# Altium project BMS_MasterboardUpdated.PrjPcb (part 1 of 2)
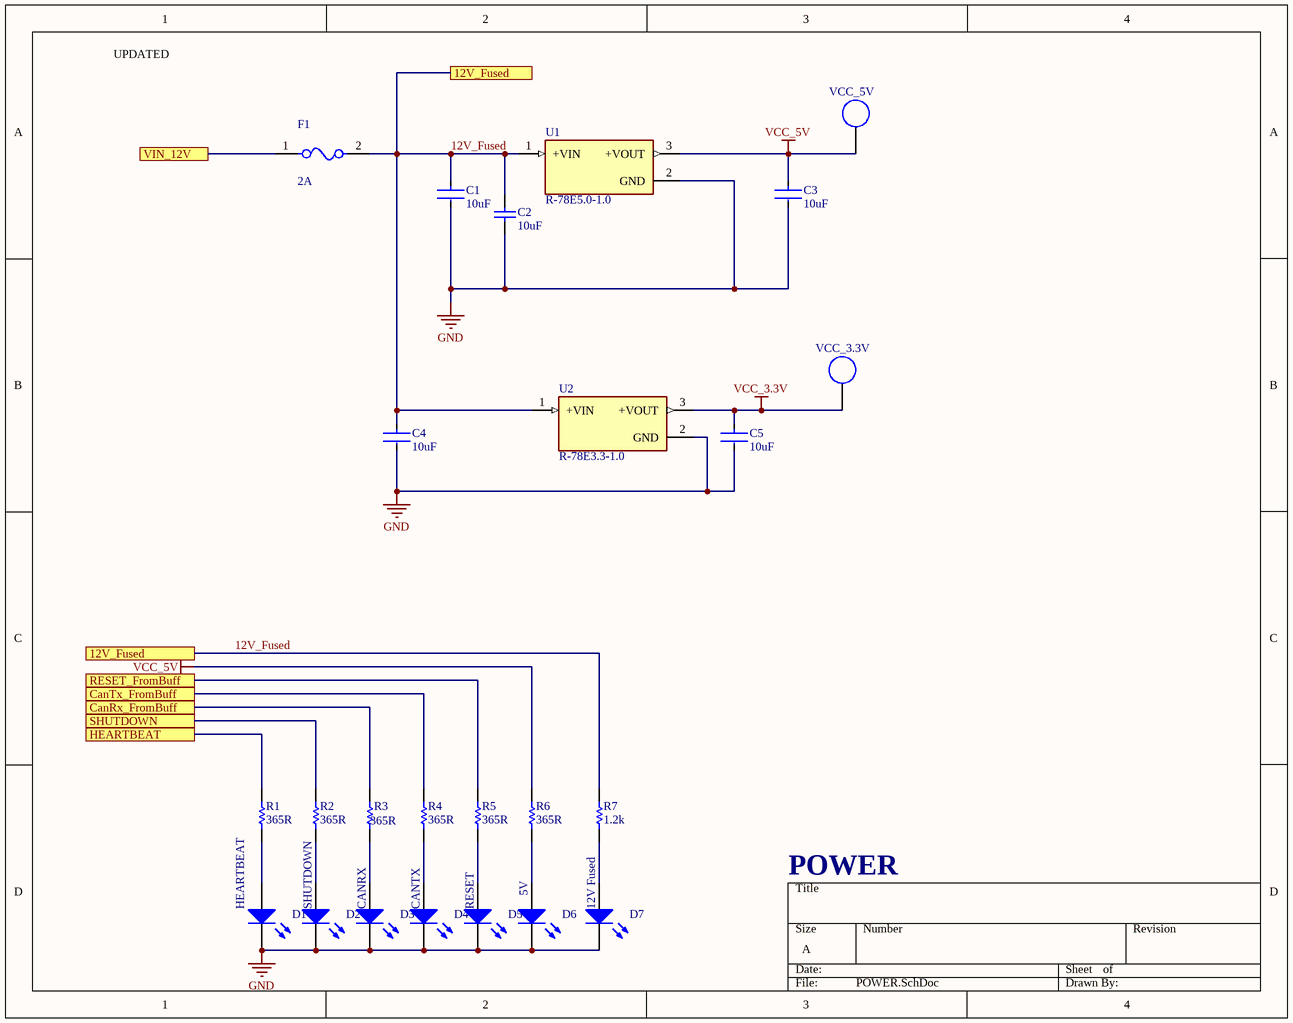
[diagram p0: POWER.SchDoc]
4 sheets, 102 parts. Net scope: flat (ports and power ports of the same name join across sheets).
Board files: MasterBoardRevA.PcbDoc, MasterBoardRevB.PcbDoc, MasterBoardRevC.PcbDoc
Sheets:
  POWER.SchDoc
  CONNECTORS.SchDoc
  PROCESSOR.SchDoc
  COMMUNICATIONS.SchDoc

## Sheet POWER.SchDoc
size A

### Parts
C1  10uF  [FP-C2012-125-0_2-MFG]
C2  10uF  [CAPPRD200W50D550H1250]
C3  10uF  [FP-C2012-125-0_2-MFG]
C4  10uF  [FP-C2012-125-0_2-MFG]
C5  10uF  [FP-C2012-125-0_2-MFG]
D1  HEARTBEAT  [0805_A]
D2  SHUTDOWN  [0805_A]
D3  CANRX  [0805_A]
D4  CANTX  [0805_A]
D5  RESET  [0805_A]
D6  5V  [0805_A]
D7  12V Fused  [0805_A]
F1  2A  [FP-0154-MFG]
R1  365R  [RESC2013X60X35ML10T20]
R2  365R  [RESC2013X60X35ML10T20]
R3  365R  [RESC2013X60X35ML10T20]
R4  365R  [RESC2013X60X35ML10T20]
R5  365R  [RESC2013X60X35ML10T20]
R6  365R  [RESC2013X60X35ML10T20]
R7  1.2k  [RESC2013X60X35ML10T20]
U1  R-78E5.0-1.0  [CONV_R-78E5.0-1.0]
U2  R-78E3.3-1.0  [CONV_R-78E3.3-1.0]
VCC_3.3V  5015  [5015]  (value not drawn)
VCC_5V  5015  [5015]  (value not drawn)

### Ports
12V_Fused, CanRx_FromBuff, CanTx_FromBuff, HEARTBEAT, RESET_FromBuff, SHUTDOWN, VIN_12V

### Nets
GND: C1.2 C2.2(Neg) C3.2 C4.2 C5.2 D1.1(K) D2.1(K) D3.1(K) D4.1(K) D5.1(K) D6.1(K) D7.1(K) U1.2(GND) U2.2(GND)
VCC_3.3V: C5.1 U2.3(+VOUT) VCC_3.3V.1
VCC_5V: C3.1 R6.2 U1.3(+VOUT) VCC_5V.1
12V_Fused: C1.1 C2.1(Pos) C4.1 F1.2 R7.2 U1.1(+VIN) U2.1(+VIN) ; port 12V_Fused
CanRx_FromBuff: R3.2 ; port CanRx_FromBuff
CanTx_FromBuff: R4.2 ; port CanTx_FromBuff
HEARTBEAT: R1.2 ; port HEARTBEAT
RESET_FromBuff: R5.2 ; port RESET_FromBuff
SHUTDOWN: R2.2 ; port SHUTDOWN
NetD1_2: D1.2(A) R1.1
NetD2_2: D2.2(A) R2.1
NetD3_2: D3.2(A) R3.1
NetD4_2: D4.2(A) R4.1
NetD5_2: D5.2(A) R5.1
NetD6_2: D6.2(A) R6.1
NetD7_2: D7.2(A) R7.1
NetF1_1: F1.1 ; port VIN_12V

### Notes on the sheet
- (near F1) UPDATED
- POWER

### Library data of the parts
C1 C3-C5 = CMP-08246-003655-1: Multilayer Ceramic Capacitors 10μF ±10% 16V X6S SMD 0805; Contact Plating: Tin; Height: 1.25mm; Thickness: 0.057inch; Case Code (Metric): 2012; Dielectric Material: Ceramic; Tolerance: 10%; Depth: 1.25mm; Length: 2mm; Lead Free: Lead Free; RoHS Compliant: Yes; Case/Package: 0805; REACH SVHC: No SVHC; Capacitance: 10uF; Construction: Flat; Voltage Rating: 16V; Max Operating Temperature: 105°C; Series: C; Width: 0.049inch; Voltage Rating (DC): 16V; Packaging: Tape and Reel; Package Quantity: 1; Min Operating Temperature: -55°C; Mount: Surface Mount; Dielectric: X6S; Case Code (Imperial): 0805; Supplier 1: Digi-Key; Supplier Part Number 1: 445-7611-1-ND
C2 = Cap, TH, Electrolytic_5mm: Cap Alum 10UF 20% 25V Radial; Manufacturer 1: KEMET; Manufacturer Part Number 1: ESW106M025AC3AA; TargetLibrary: RITRacing-Passives; Value: Value?; Publisher: T.Tallo; Published: 22Oct2016; Status: Active; Supplier 1: Digi-Key; Supplier Part Number 1: 399-ESW106M025AC3AA-ND; Stock 1: 7476; Pricing 1: 1=0.23000, 10=0.15400, 50=0.09260, 100=0.07820, 500=0.05352, 1000=0.04735, 2500=0.04529, 5000=0.04117 (USD); RoHS Compliant: Yes
D1-D7 = CMP-1426-00009-1: SMD mono-color Chip LED, WL-SMCW, Bright Green; PartNumber: 150080VS75000; Manufacturer: Wuerth Elektronik; Manufacturer 1: Wurth Electronics; Luminous Intensity: 40mcd; Forward Current: 30mA; Forward Voltage: 2V; Viewing Angle: 140°; Wavelength: 570nm; Lens Style: Clear,Rectangular; Test Current: 20mA; ComponentLink1Description: Manufacturer URL; Color: Bright Green; PackageReference: 0805_A; ComponentLink1URL: http://www.we-online.com; ComponentLink2Description: Datasheet; ComponentLink2URL: http://katalog.we-online.com/led/datasheet/150080VS75000.pdf; Supplier 1: Digi-Key; Supplier Part Number 1: 732-4986-1-ND; Manufacturer Part Number 1: 150080VS75000; RoHS: Yes; Category: LEDs; Stock 1: 20997; Pricing 1: 1=0.18000, 50=0.16500, 100=0.14200, 500=0.12300 (USD); Mount: Surface Mount; Case/Package: 0805; Case Code (Metric): 2012; Case Code (Imperial): 0805; Min Operating Temperature: -40°C; Max Operating Temperature: 85°C; Package Quantity: 4000; Packaging: Tape and Reel; Dominant Wavelength: 570nm; Length: 2mm; Width: 1.25mm; Height: 0.7mm; REACH SVHC: Unknown; ComponentLink3URL: https://datasheet.ciiva.com/22656/150080vs75000-22656966.pdf?src-supplier=Element14; ComponentLink3Description: https://datasheet.ciiva.com/22656/150080vs75000-22656966.pdf?src-supplier=Element14; ComponentLink4URL: https://datasheet.ciiva.com/29279/759437-da-01-en-chipled-0805-w-kl-h-gruen-150080vs7500-29279047.pdf?src-supplier=Conrad; ComponentLink4Description: https://datasheet.ciiva.com/29279/759437-da-01-en-chipled-0805-w-kl-h-gruen-150080vs7500-29279047.pdf?src-supplier=Conrad; ComponentLink5URL: https://datasheet.ciiva.com/29563/150080vs75000-29563018.pdf?src-supplier=Digi-Key; ComponentLink5Description: https://datasheet.ciiva.com/29563/150080vs75000-29563018.pdf?src-supplier=Digi-Key
F1 = CMP-08605-000033-1: FUSE BOARD MNT 2A 125VAC/VDC SMD; Manufacturer Part Number: 0154002.DR; Manufacturer: Littelfuse; Fuse I2T: 8.2A2Sec; Voltage Rating: 125V; Value: 0.0625Ω; Fuse Blow Speed: Fast; ComponentLink2URL: https://www.littelfuse.com/~/media/electronics/datasheets/fuses/littelfuse_fuse_154_154t_154l_154tl_datasheet.pdf.pdf; Digikey Description: FUSE BOARD MNT 2A 125VAC/VDC SMD; Temperature Range Low: -55°C; Mouser Description: 154 Series Fast-Acting 125 V 2 A 9.73 x 5.03 mm OMNI-BLOK® SMT Fuse & Holder; Device Class L1: Circuit Protection; Temperature: -55°C to +125°C; Automotive: No; ComponentLink2Description: Datasheet; Device Class L3: unset; Octopart: https://octopart.com/0154002.dr-littelfuse-565858; Height: 3.81mm; Fuse Current: 2A; Temperature Range High: +125°C; RoHS: TRUE; Max Fuse Ac Voltage: 125V; Category: Fuse; Package: 0154; Lead Free: Yes; Device Class L2: Fuses; Max Fuse Dc Voltage: 125V; Resistance: 0.0625Ω; Supplier 1: Digi-Key; Supplier Part Number 1: F1224CT-ND
R1-R6 = CMP-2001-01100-1: Part Number: RC0805FR-07365RL; Manufacturer: Yageo
R7 = CMP-2001-00959-1: Part Number: RC0805FR-071K24L; Manufacturer: Yageo
U1 = R-78E5.0-1.0: 1A DC/DC-Converter 'INNOLINE' SIP3 reg; MF: Recom Power; Price: None; Availability: Unavailable; SnapEDA_Link: https://www.snapeda.com/parts/R-78E5.0-1.0/Recom%20Power/view-part/557753/?ref=snap; Value: *; Package: SIP-3 Recom Power; MP: R-78E5.0-1.0; Supplier 1: Digi-Key; Supplier Part Number 1: 945-2201-ND
U2 = R-78E3.3-1.0: 1A DC/DC-Converter 'INNOLINE' SIP3 reg; MF: Recom Power; Package: SIP-3 Recom Power; Digi-Key_Part_Number: 945-2409-5-ND; SnapEDA_Link: https://www.snapeda.com/parts/R-78E3.3-0.5/Recom%20Power/view-part/229066/?ref=snap; Digi-Key_Purchase_URL: https://www.digikey.com/en/products/detail/recom-power/R-78E3-3-1-0/5327711; Value: *; MP: R-78E3.3-1.0; Supplier 1: Digi-Key; Supplier Part Number 1: 945-2409-5-ND
VCC_3.3V VCC_5V = 5015: SMD Test Point; Manufacturer: Keystone Electronics; TargetLibrary: RITRacing-Connectors; PartNumber: 5015; Publisher: T.Tallo; Published: 22Oct2016; Status: Active; ComponentLink1URL: http://www.mouser.com/ds/2/215/005-5009-743680.pdf; ComponentLink1Description: Datasheet

## Sheet CONNECTORS.SchDoc
size A
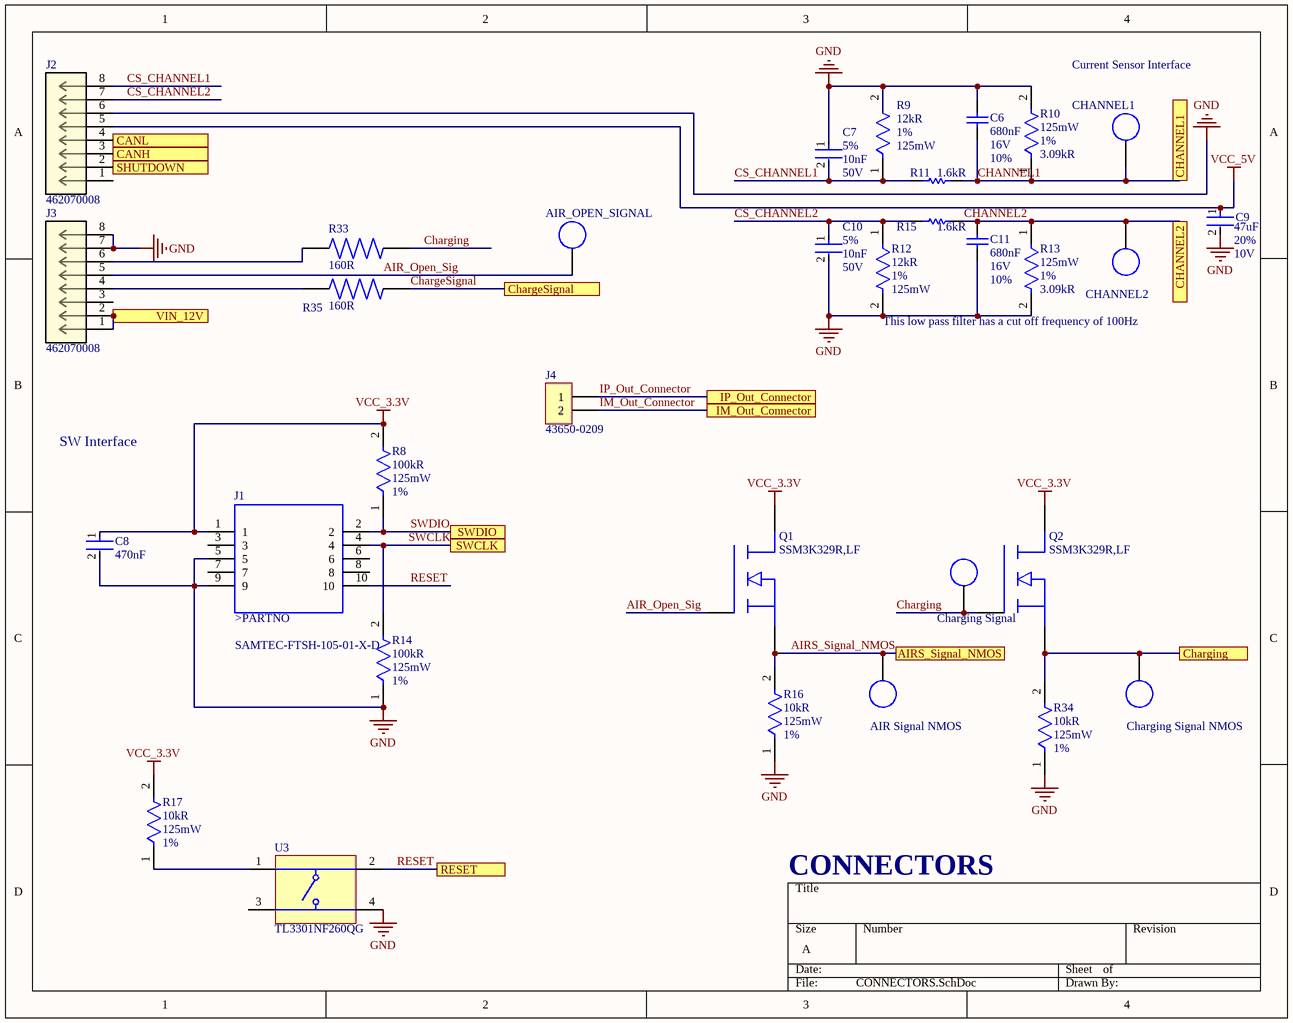
[diagram p1: CONNECTORS.SchDoc]

### Parts
AIR_OPEN_SIGNAL  5015  [5015]  (value not drawn)
AIR_Signal_NMOS  5015  [5015]  (value not drawn)
C6  Capacitance: 680nF  Voltage Rating: 16V  Tolerance: 10%  [CAPC2013X95X45NL10T25]  (hidden comment: GRM219R71C684KA01D)
C7  Tolerance: 5%  Capacitance: 10nF  Voltage Rating (DC): 50V  [FP-GRM219-0_1-IPC_B]  (hidden comment: GRM2195C1H103JA01D)
C8  470nF  [FP-GCM21B-0_15-IPC_A]
C9  Capacitance: 47uF  Tolerance: 20%  Voltage: 10V  [FP-GRM21B-0_2-e0_2_0_7-IPC_A]  (hidden comment: GRM21BR61A476ME15L)
C10  Tolerance: 5%  Capacitance: 10nF  Voltage Rating (DC): 50V  [FP-GRM219-0_1-IPC_B]  (hidden comment: GRM2195C1H103JA01D)
C11  Capacitance: 680nF  Voltage Rating: 16V  Tolerance: 10%  [CAPC2013X95X45NL10T25]  (hidden comment: GRM219R71C684KA01D)
CHANNEL1  5015  [5015]  (value not drawn)
CHANNEL2  5015  [5015]  (value not drawn)
Charging_Signal  5015  [5015]  (value not drawn)
Charging_Signal_NMOS  5015  [5015]  (value not drawn)
J1  SAMTEC-FTSH-105-01-X-D  [SAMTEC-FTSH-105-01-X-D]  (value not drawn)
J2  462070008  [CON_462070008]
J3  462070008  [CON_462070008]
J4  43650-0209  [43650-0209]
Q1  SSM3K329R,LF  [SOT23-3]
Q2  SSM3K329R,LF  [SOT23-3]
R8  Resistance: 100kR  Power Rating: 125mW  Tolerance: 1%  [FP-CRCW0805-e3-MFG]  (hidden comment: CRCW0805100KFKEA)
R9  Resistance: 12kR  Tolerance: 1%  Max Power Dissipation: 125mW  [FP-CRCW0805-e3-IPC_A]  (hidden comment: CRCW080512K0FKEA)
R10  Power Rating: 125mW  Tolerance: 1%  Resistance: 3.09kR  [FP-CRCW0805-e3-IPC_C]  (hidden comment: CRCW08053K09FKEA)
R11  Resistance: 1.6kR  [RESC2013X50X30LL20T20]  (hidden comment: CRCW08051K60FKEA)
R12  Resistance: 12kR  Tolerance: 1%  Max Power Dissipation: 125mW  [FP-CRCW0805-e3-IPC_A]  (hidden comment: CRCW080512K0FKEA)
R13  Power Rating: 125mW  Tolerance: 1%  Resistance: 3.09kR  [FP-CRCW0805-e3-IPC_C]  (hidden comment: CRCW08053K09FKEA)
R14  Resistance: 100kR  Power Rating: 125mW  Tolerance: 1%  [FP-CRCW0805-e3-MFG]  (hidden comment: CRCW0805100KFKEA)
R15  Resistance: 1.6kR  [RESC2013X50X30LL20T20]  (hidden comment: CRCW08051K60FKEA)
R16  Resistance: 10kR  Power Rating: 125mW  Resistance Tolerance: 1%  [FP-CRCW0805-e3-IPC_A]  (hidden comment: CRCW080510K0FKEA)
R17  Resistance: 10kR  Power Rating: 125mW  Resistance Tolerance: 1%  [FP-CRCW0805-e3-IPC_A]  (hidden comment: CRCW080510K0FKEA)
R33  Resistance: 160R  [RES_ERJP06J161V]  (hidden comment: ERJP06J161V)
R34  Resistance: 10kR  Power Rating: 125mW  Resistance Tolerance: 1%  [FP-CRCW0805-e3-IPC_A]  (hidden comment: CRCW080510K0FKEA)
R35  Resistance: 160R  [RES_ERJP06J161V]  (hidden comment: ERJP06J161V)
U3  TL3301NF260QG  [TECO-FSM4JSMA_V]

### Ports
AIRS_Signal_NMOS, CANH, CANL, CHANNEL1, CHANNEL2, ChargeSignal, Charging, IM_Out_Connector, IP_Out_Connector, RESET, SHUTDOWN, SWCLK, SWDIO, VIN_12V

### Nets
GND: C6.2 C7.1 C8.2 C9.2 C10.2 C11.1 J1.5 J1.9 J2.6 J3.7 J3.8 R9.2 R10.2 R12.2 R13.2 R14.1 R16.1 R34.1 U3.4
VCC_3.3V: C8.1 J1.1 Q1.3(Drain) Q2.3(Drain) R8.2 R17.2
VCC_5V: C9.1 J2.5
AIR_Open_Sig: AIR_OPEN_SIGNAL.1 J3.5 Q1.1(Gate)
AIRS_Signal_NMOS: AIR_Signal_NMOS.1 Q1.2(Source) R16.2 ; port AIRS_Signal_NMOS
CANH: J2.3 ; port CANH
CANL: J2.4 ; port CANL
CHANNEL1: C6.1 CHANNEL1.1 R10.1 R11.2 ; port CHANNEL1
CHANNEL2: C11.2 CHANNEL2.1 R13.1 R15.2 ; port CHANNEL2
ChargeSignal: R35.1 ; port ChargeSignal
Charging: Charging_Signal_NMOS.1 Q2.2(Source) R34.2 ; port Charging
Charging: Charging_Signal.1 Q2.1(Gate) R33.1  [a separate net that carries the same name]
CS_CHANNEL1: C7.2 J2.8 R9.1 R11.1
CS_CHANNEL2: C10.1 J2.7 R12.1 R15.1
IM_Out_Connector: J4.2 ; port IM_Out_Connector
IP_Out_Connector: J4.1 ; port IP_Out_Connector
RESET: J1.10 U3.2 ; port RESET
SHUTDOWN: J2.2 ; port SHUTDOWN
SWCLK: J1.4 R14.2 ; port SWCLK
SWDIO: J1.2 R8.1 ; port SWDIO
NetF1_1: J3.1 J3.2 ; port VIN_12V
NetJ3_4: J3.4 R35.2
NetJ3_6: J3.6 R33.2
NetR17_1: R17.1 U3.1

Not connected (* = marked no-connect by the designer): J1 3 6 7 8; J2 1; J3 3; U3 3

### Notes on the sheet
- Current Sensor Interface
- This low pass filter has a cut off frequency of 100Hz
- SW Interface
- CONNECTORS
- (in symbol SAMTEC-FTSH-105-01-X-D) >PARTNO

### Library data of the parts
AIR_OPEN_SIGNAL AIR_Signal_NMOS CHANNEL1 CHANNEL2 Charging_Signal Charging_Signal_NMOS = 5015: as VCC_3.3V on sheet POWER; PartNumber: 5015; Publisher: T.Tallo; Published: 22Oct2016; Status: Active; ComponentLink1URL: http://www.mouser.com/ds/2/215/005-5009-743680.pdf; ComponentLink1Description: Datasheet
C6 C11 = CMP-2007-00190-1: Manufacturer: Murata; Material: Ceramic; Dielectric: X7R; Part Number: GRM219R71C684KA01D; Supplier 1: Digi-Key; Supplier Part Number 1: 490-4741-1-ND; Manufacturer 1: Murata; Manufacturer Part Number 1: GRM219R71C684KA01D; RoHS: Yes; Category: Ceramic Capacitors; Stock 1: 28535; Pricing 1: 1=0.33000, 10=0.22300, 50=0.14860, 100=0.12630, 500=0.08914, 1000=0.07800 (USD); Mount: Surface Mount; Case/Package: 0805; Case Code (Imperial): 0805; Case Code (Metric): 2012; Min Operating Temperature: -55°C; Max Operating Temperature: 125°C; Voltage Rating (DC): 16V; Packaging: Tape and Reel; Package Quantity: 1; Termination: SMD/SMT; Series: GRM; Construction: Flat; Voltage: 16V; Length: 2mm; Width: 1.25mm; Height: 0.85mm; Thickness: 0.037inch; Depth: 1.25mm; Radiation Hardening: No; RoHS Compliant: Yes; Lead Free: Lead Free; ComponentLink1URL: https://datasheet.ciiva.com/136/grm219r71c684ka01-01-136854.pdf?src-supplier=Digi-Key; ComponentLink1Description: https://datasheet.ciiva.com/136/grm219r71c684ka01-01-136854.pdf?src-supplier=Digi-Key; ComponentLink2URL: https://datasheet.ciiva.com/136/grm219r71c684ka01-01-136855.pdf?src-supplier=Digi-Key; ComponentLink2Description: https://datasheet.ciiva.com/136/grm219r71c684ka01-01-136855.pdf?src-supplier=Digi-Key; ComponentLink3URL: https://datasheet.ciiva.com/136/grm219r71c684ka01-01-136856.pdf?src-supplier=Digi-Key; ComponentLink3Description: https://datasheet.ciiva.com/136/grm219r71c684ka01-01-136856.pdf?src-supplier=Digi-Key; ComponentLink4URL: https://datasheet.ciiva.com/5426/product-5426512.pdf?src-supplier=Mouser; ComponentLink4Description: https://datasheet.ciiva.com/5426/product-5426512.pdf?src-supplier=Mouser; ComponentLink5URL: https://datasheet.ciiva.com/11464/product-11464042.pdf?src-supplier=Avnet; ComponentLink5Description: https://datasheet.ciiva.com/11464/product-11464042.pdf?src-supplier=Avnet; Supplier 2: Digi-Key; Supplier Part Number 2: 490-4741-6-ND; Manufacturer 2: Murata; Manufacturer Part Number 2: GRM219R71C684KA01D; Stock 2: 28535; Pricing 2: 1=0.33000, 10=0.22300, 50=0.14860, 100=0.12630, 500=0.08914, 1000=0.07800 (USD); Supplier 3: Mouser; Supplier Part Number 3: 81-GRM219R71C684KA1D; Manufacturer 3: Murata; Manufacturer Part Number 3: GRM219R71C684KA01D; Stock 3: 83; Pricing 3: 1=0.32000, 10=0.22300, 50=0.22300, 100=0.12700, 500=0.09000, 1000=0.07800, 2000=0.07500, 4000=0.06800, 8000=0.05600, 10000=0.05600 (USD)
C7 C10 = CMP-2007-00135-2: Chip Multilayer Ceramic Capacitors for General Purpose, 0805, 10000pF, C0G, 30ppm/°C, 5%, 50V; Manufacturer 1: Murata; Insulation Resistance: 10GR; Max Operating Temperature: 125°C; Height: 0.85mm; Voltage: 50V; Dielectric Material: Ceramic; Voltage Rating: 50V; Dielectric: C0G; Thickness: 0.037inch; REACH SVHC: No SVHC; Lead Free: Lead Free; Depth: 1.25mm; Min Operating Temperature: -55°C; Package Quantity: 1; Packaging: Tape and Reel; Case Code (Imperial): 0805; Case/Package: 0805; Mount: Surface Mount; Width: 0.049inch; Case Code (Metric): 2012; Length: 2mm; Termination: SMD/SMT; Material: Ceramic; Temperature Coefficient: 30ppm/°C; Number of Pins: 2; Radiation Hardening: No; Supplier 1: Newark; Supplier Part Number 1: 08AC2712; Manufacturer Part Number 1: GRM2195C1H103JA01D; RoHS: Yes; Category: Ceramic Capacitors; Stock 1: 44000; Pricing 1: 1=0.09100, 4000=0.09100 (USD); Series: GRM; Construction: Flat; Size: 0.85mm; RoHS Compliant: Yes; ComponentLink1URL: https://datasheet.ciiva.com/3777/376grm2195c1h103ja0123-3777227.pdf?src-supplier=Arrow+Electronics; ComponentLink1Description: https://datasheet.ciiva.com/3777/376grm2195c1h103ja0123-3777227.pdf?src-supplier=Arrow+Electronics; ComponentLink2URL: https://datasheet.ciiva.com/11786/0900766b807a1cab-11786595.pdf?src-supplier=RSComponents; ComponentLink2Description: https://datasheet.ciiva.com/11786/0900766b807a1cab-11786595.pdf?src-supplier=RSComponents; ComponentLink3URL: https://datasheet.ciiva.com/19476/1858501-19476200.pdf?src-supplier=Jameco; ComponentLink3Description: https://datasheet.ciiva.com/19476/1858501-19476200.pdf?src-supplier=Jameco; ComponentLink4URL: https://datasheet.ciiva.com/29200/452695-da-01-en-vs-kondensator-0805-29200853.pdf?src-supplier=Conrad; ComponentLink4Description: https://datasheet.ciiva.com/29200/452695-da-01-en-vs-kondensator-0805-29200853.pdf?src-supplier=Conrad; ComponentLink5URL: https://datasheet.ciiva.com/138/partnumbering-e-01-138167.pdf?src-supplier=Digi-Key; ComponentLink5Description: https://datasheet.ciiva.com/138/partnumbering-e-01-138167.pdf?src-supplier=Digi-Key; ComponentLink6URL: https://datasheet.ciiva.com/138/partnumbering-e-01-138165.pdf?src-supplier=Digi-Key; ComponentLink6Description: https://datasheet.ciiva.com/138/partnumbering-e-01-138165.pdf?src-supplier=Digi-Key; ComponentLink7URL: https://datasheet.ciiva.com/138/partnumbering-e-01-138166.pdf?src-supplier=Digi-Key; ComponentLink7Description: https://datasheet.ciiva.com/138/partnumbering-e-01-138166.pdf?src-supplier=Digi-Key; ComponentLink8URL: https://datasheet.ciiva.com/2989/product-2989652.pdf?src-supplier=Avnet; ComponentLink8Description: https://datasheet.ciiva.com/2989/product-2989652.pdf?src-supplier=Avnet; ComponentLink9URL: https://datasheet.ciiva.com/11620/product-11620062.pdf?src-supplier=Avnet; ComponentLink9Description: https://datasheet.ciiva.com/11620/product-11620062.pdf?src-supplier=Avnet; ComponentLink10URL: https://datasheet.ciiva.com/7828/4360-7828972.pdf?src-supplier=Element14; ComponentLink10Description: https://datasheet.ciiva.com/7828/4360-7828972.pdf?src-supplier=Element14; ComponentLink11URL: https://datasheet.ciiva.com/7828/1747462-7828970.pdf?src-supplier=Element14; ComponentLink11Description: https://datasheet.ciiva.com/7828/1747462-7828970.pdf?src-supplier=Element14; ComponentLink12URL: https://datasheet.ciiva.com/7828/1747462-7828971.pdf?src-supplier=Element14; ComponentLink12Description: https://datasheet.ciiva.com/7828/1747462-7828971.pdf?src-supplier=Element14; Supplier 2: Digi-Key; Supplier Part Number 2: 490-1642-1-ND; Manufacturer 2: Murata; Manufacturer Part Number 2: GRM2195C1H103JA01D; Pricing 2: 1=0.38000, 10=0.25900, 50=0.17300, 100=0.14700, 500=0.10378, 1000=0.09080 (USD)
C8 = CMP-2007-03360-2: Ceramic Capacitor for Automotive 470nF ±10% 50VDC X7R 0805 Embossed T/R; Manufacturer 1: Murata; Manufacturer Part Number 1: GCM21BR71H474KA55K; Voltage Rating (DC): 50V; Case Code (Imperial): 0805; Length: 2mm; Thickness: 0.055inch; Width: 0.049inch; Dielectric: X7R; Termination: SMD/SMT; Case Code (Metric): 2012; Packaging: Tape and Reel; Capacitance: 470nF; Case/Package: 0805; Radiation Hardening: No; Depth: 1.25mm; Max Operating Temperature: 125°C; Tolerance: 10%; Package Quantity: 10000; Height: 1.25mm; Mount: Surface Mount; Ratings: AEC-Q200; Min Operating Temperature: -55°C; Voltage Rating: 50V; Supplier 1: Digi-Key; Supplier Part Number 1: 490-11164-1-ND; RoHS: Yes; Category: Ceramic Capacitors; Stock 1: 26700; Pricing 1: 1=0.30000, 10=0.20800, 50=0.13860, 100=0.11780, 500=0.08318, 1000=0.07279, 2500=0.06932, 5000=0.06412 (USD); Series: GCM; Construction: Flat; RoHS Compliant: Yes; ComponentLink1URL: https://datasheet.ciiva.com/171/product-171550.pdf?src-supplier=Digi-Key; ComponentLink1Description: https://datasheet.ciiva.com/171/product-171550.pdf?src-supplier=Digi-Key; ComponentLink2URL: https://datasheet.ciiva.com/11673/product-11673422.pdf?src-supplier=Avnet; ComponentLink2Description: https://datasheet.ciiva.com/11673/product-11673422.pdf?src-supplier=Avnet
C9 = CMP-2000-06341-2: Chip Multilayer Ceramic Capacitors for General Purpose, 0805, 47uF, X5R, 15%, 20%, 10V; Manufacturer 1: Murata; Dissipation Factor: 0.035%; Length: 2mm; Voltage Rating: 10V; Mount: Surface Mount; Width: 0.049inch; Voltage Rating (DC): 10V; Lead Free: Lead Free; REACH SVHC: No SVHC; Termination: SMD/SMT; Case/Package: 0805; Dielectric: X5R; Packaging: Tape and Reel; Max Operating Temperature: 85°C; Thickness: 0.057inch; Dielectric Material: Ceramic; Min Operating Temperature: -55°C; Height: 1.25mm; Case Code (Imperial): 0805; Case Code (Metric): 2012; Depth: 1.25mm; Supplier 1: Digi-Key; Supplier Part Number 1: 490-9961-2-ND; Manufacturer Part Number 1: GRM21BR61A476ME15L; RoHS: Yes; Category: Ceramic Capacitors; Stock 1: 291985; Pricing 1: 3000=0.19360 (USD); RoHS Compliant: Yes; ComponentLink1URL: http://www.farnell.com/datasheets/2079183.pdf?src-supplier=Farnell; ComponentLink1Description: http://www.farnell.com/datasheets/2079183.pdf?src-supplier=Farnell; ComponentLink2URL: http://components.arrow.com/part/dataview/0323_07199600?src-supplier=Arrow+Europe; ComponentLink2Description: http://components.arrow.com/part/dataview/0323_07199600?src-supplier=Arrow+Europe; ComponentLink3URL: http://psearch.en.murata.com/capacitor/product/GRM21BR61A476ME15%23.pdf?src-supplier=Avnet; ComponentLink3Description: http://psearch.en.murata.com/capacitor/product/GRM21BR61A476ME15%23.pdf?src-supplier=Avnet; ComponentLink4URL: https://search.murata.co.jp/Ceramy/image/img/A01X/G101/ENG/GRM21BR61A476ME15-01.pdf?src-supplier=Digi-Key; ComponentLink4Description: https://search.murata.co.jp/Ceramy/image/img/A01X/G101/ENG/GRM21BR61A476ME15-01.pdf?src-supplier=Digi-Key; ComponentLink5URL: http://search.murata.co.jp/Ceramy/image/img/A01X/G101/ENG/GRM21BR61A476ME15-01.pdf?src-supplier=Digi-Key; ComponentLink5Description: http://search.murata.co.jp/Ceramy/image/img/A01X/G101/ENG/GRM21BR61A476ME15-01.pdf?src-supplier=Digi-Key; ComponentLink6URL: http://www.farnell.com/datasheets/2079183.pdf?src-supplier=Element14; ComponentLink6Description: http://www.farnell.com/datasheets/2079183.pdf?src-supplier=Element14; ComponentLink7URL: http://www.farnell.com/datasheets/2079183.pdf?src-supplier=Newark; ComponentLink7Description: http://www.farnell.com/datasheets/2079183.pdf?src-supplier=Newark
J1 = SAMTEC-FTSH-105-01-X-D: CONN HEADER SMD 10POS 1.27MM; Manufacturer Part Number 1: FTSH-105-01-L-DV-K; MP: FTSH-105-01-F-D; MF: Samtec; Number of Contacts: 10; Gender: Male; Max Current Rating: 1.75A; Connector Type: Male Pin; Row Spacing: 0.05inch; Value: *; Package: None; SnapEDA_Link: https://www.snapeda.com/parts/FTSH-105-01-F-D/Samtec%20Inc./view-part/105348/?ref=snap; Price: None; Availability: Unavailable; Supplier 1: Digi-Key; Supplier Part Number 1: SAM8799-ND; Manufacturer 1: Samtec; RoHS: Yes; Category: Headers and Wire Housings; Stock 1: 38057; Pricing 1: 1=3.91000, 10=3.75700, 92=3.13098, 460=2.66135, 1012=2.26997 (USD); Mount: Surface Mount; Contact Material: Bronze; Contact Plating: Gold; Housing Color: Black; Housing Material: Polymer; Color: Black; Min Operating Temperature: -55°C; Max Operating Temperature: 125°C; Number of Rows: 2; Packaging: Rail/Tube; Termination: Solder; Orientation: Straight; Number of Positions: 10; Series: FTSH; Contact Type: Male Pin; Package Quantity: 1; Length: 6.35mm; Pitch: 1.27mm; Depth: 3.43mm; Contact Mating Length: 0.12inch; Radiation Hardening: No; RoHS Compliant: Yes; Lead Free: Lead Free; REACH SVHC: No SVHC; ComponentLink1URL: https://datasheet.ciiva.com/26936/getdatasheetpartid-175877-26936879.pdf?src-supplier=Verical; ComponentLink1Description: https://datasheet.ciiva.com/26936/getdatasheetpartid-175877-26936879.pdf?src-supplier=Verical; ComponentLink2URL: https://datasheet.ciiva.com/22703/ftsh-smt-22703900.pdf?src-supplier=Element14; ComponentLink2Description: https://datasheet.ciiva.com/22703/ftsh-smt-22703900.pdf?src-supplier=Element14; ComponentLink3URL: https://datasheet.ciiva.com/10245/ftsh-mt-10245272.pdf?src-supplier=Avnet; ComponentLink3Description: https://datasheet.ciiva.com/10245/ftsh-mt-10245272.pdf?src-supplier=Avnet; ComponentLink4URL: https://datasheet.ciiva.com/16657/ftsh-mt-16657372.pdf?src-supplier=Avnet+Europe; ComponentLink4Description: https://datasheet.ciiva.com/16657/ftsh-mt-16657372.pdf?src-supplier=Avnet+Europe; ComponentLink5URL: https://datasheet.ciiva.com/728/ftsh-1xx-xx-xxx-dv-xxx-mkt-728872.pdf?src-supplier=Digi-Key; ComponentLink5Description: https://datasheet.ciiva.com/728/ftsh-1xx-xx-xxx-dv-xxx-mkt-728872.pdf?src-supplier=Digi-Key
J2 J3 = 462070008: Conn Power HDR 8 POS 4.2mm Solder ST Thru-Hole 8 Terminal 1 Port Mini-Fit Jr™ Frame; Mfr_Name: Molex Connector Corporation; Manufacturer 1: Molex; Manufacturer Part Number 1: 46207-0008; Number of Contacts: 8; Max Voltage Rating (DC): 600.6kV; Connector Type: Male Pin; Current Rating: 13A; Voltage Rating: 600V; Row Spacing: 0.165inch; Glow Wire Compliant: Compliant; Copyright: Copyright (C) 2021 Ultra Librarian. All rights reserved.; Manufacturer_Part_Number: 462070008; RefDes: RefDes; Type: DEV; RoHS: Yes; Category: Headers and Wire Housings; Stock 1: 3111; Pricing 1: 1=2.76000, 10=2.34700, 80=1.93888, 3120=1.42868, 6240=1.35724 (USD); Mount: Through Hole; Contact Plating: Tin; Contact Material: Brass; Color: Black; Housing Material: Polymer; Min Operating Temperature: -40°C; Max Operating Temperature: 105°C; Termination: Solder; Number of Rows: 2; Orientation: Vertical; Packaging: Tray; Fastening Type: Ramp; Number of Positions: 8; Series: Mini-Fit® 46207; Contact Type: Male Pin; Package Quantity: 1; Contact Gender: Male; Voltage Rating (AC): 600V; Number of Circuits: 8; Pitch: 4.2mm; Radiation Hardening: No; RoHS Compliant: Yes; Halogen Free: Low Halogen; ComponentLink1URL: https://datasheet.ciiva.com/726/462070004-sd-726556.pdf?src-supplier=Digi-Key; ComponentLink1Description: https://datasheet.ciiva.com/726/462070004-sd-726556.pdf?src-supplier=Digi-Key; ComponentLink2URL: https://datasheet.ciiva.com/5159/0462070008-pcb-headers-169853-5159064.pdf?src-supplier=Mouser; ComponentLink2Description: https://datasheet.ciiva.com/5159/0462070008-pcb-headers-169853-5159064.pdf?src-supplier=Mouser; ComponentLink3URL: https://datasheet.ciiva.com/11751/0900766b80b0ac72-11751180.pdf?src-supplier=RSComponents; ComponentLink3Description: https://datasheet.ciiva.com/11751/0900766b80b0ac72-11751180.pdf?src-supplier=RSComponents; ComponentLink4URL: https://datasheet.ciiva.com/30199/145480462070008-pcb-headers-30199794.pdf?src-supplier=Onlinecomponents.com; ComponentLink4Description: https://datasheet.ciiva.com/30199/145480462070008-pcb-headers-30199794.pdf?src-supplier=Onlinecomponents.com; ComponentLink5URL: https://datasheet.ciiva.com/25289/1630792-25289386.pdf?src-supplier=Newark; ComponentLink5Description: https://datasheet.ciiva.com/25289/1630792-25289386.pdf?src-supplier=Newark; ComponentLink6URL: https://datasheet.ciiva.com/16653/0462070008-pcb-headers-16653783.pdf?src-supplier=Avnet+Europe; ComponentLink6Description: https://datasheet.ciiva.com/16653/0462070008-pcb-headers-16653783.pdf?src-supplier=Avnet+Europe; Supplier 1: Digi-Key; Supplier Part Number 1: WM21377-ND
J4 = 43650-0209: Molex 2 Position Board Header, RIght Angle; TargetLibrary: RITRacing-Connectors; Voltage: 600V; PartNumber: 43650-0209; Manufacturer: Molex; Publisher: T.Tallo; Published: 13Aug2018; Status: Active; ComponentLink1URL: http://www.mouser.com/ds/2/418/NG_CD_1445088_A1-614413.pdf; ComponentLink1Description: Datasheet; Supplier 1: Mouser; Supplier Part Number 1: 538-43650-0209; Supplier 2: Digi-Key
Q1 Q2 = SSM3K329R,LF: N-Channel MOSFET, 30V, 3.5A; Manufacturer: Toshiba; TargetLibrary: RITRacing-Transistors; PartNumber: SSM3K329R,LF; Publisher: T.Tallo; Published: 09/27/2017; Status: Active; ComponentLink1URL: See Digikey; ComponentLink1Description: Datasheet; Supplier 1: Digi-Key; Supplier Part Number 1: SSM3K329RLFDKR-ND
R8 R14 = CMP-2001-04899-2: RES Thick Film, 100kΩ, 1%, 0.125W, 100ppm/°C, 0805; Manufacturer 1: Vishay; Voltage Rating: 150V; Case/Package: 0805; Max Operating Temperature: 155°C; Case Code (Imperial): 0805; Lead Free: Lead Free; Weight: 0.000194oz; Number of Pins: 2; Package Quantity: 5000; Height: 0.45mm; Composition: Thick Film; Military Standard: Not; Case Code (Metric): 2012; Termination: SMD/SMT; Mount: Surface Mount; Radiation Hardening: No; Width: 1.25mm; Length: 2mm; Depth: 1.25mm; Packaging: Tape and Reel; Min Operating Temperature: -55°C; Contact Plating: Tin; Temperature Coefficient: 100ppm/°C; Voltage Rating (DC): 150V; Supplier 1: Digi-Key; Supplier Part Number 1: 541-100KCCT-ND; Manufacturer Part Number 1: CRCW0805100KFKEA; RoHS: Yes; Category: Chip SMD Resistors; Stock 1: 135309; Pricing 1: 1=0.10000, 10=0.06700, 100=0.02710, 1000=0.01219, 2500=0.01058 (USD); Size Code: 0805; Resistor Type: Thick Film; Features: Automotive AEC-Q200; Series: CRCW; Max Power Dissipation: 125mW; Number of Terminations: 2; Technology: THICK FILM; Construction: Rectangular; Resistance Tolerance: 1%; RoHS Compliant: Yes; REACH SVHC: Unknown; ComponentLink1URL: https://datasheet.ciiva.com/11809/0900766b80d98b26-11809057.pdf?src-supplier=RSComponents; ComponentLink1Description: https://datasheet.ciiva.com/11809/0900766b80d98b26-11809057.pdf?src-supplier=RSComponents; ComponentLink2URL: https://datasheet.ciiva.com/8337/dcrcwe3-8337738.pdf?src-supplier=Avnet; ComponentLink2Description: https://datasheet.ciiva.com/8337/dcrcwe3-8337738.pdf?src-supplier=Avnet; ComponentLink3URL: https://datasheet.ciiva.com/3258/dcrcwe3-3258006.pdf?src-supplier=Avnet; ComponentLink3Description: https://datasheet.ciiva.com/3258/dcrcwe3-3258006.pdf?src-supplier=Avnet; ComponentLink4URL: https://datasheet.ciiva.com/16754/70201119-16754822.pdf?src-supplier=Allied+Electronics; ComponentLink4Description: https://datasheet.ciiva.com/16754/70201119-16754822.pdf?src-supplier=Allied+Electronics; ComponentLink5URL: https://datasheet.ciiva.com/7777/1697337-7777349.pdf?src-supplier=Element14; ComponentLink5Description: https://datasheet.ciiva.com/7777/1697337-7777349.pdf?src-supplier=Element14; ComponentLink6URL: https://datasheet.ciiva.com/7777/1720486-7777565.pdf?src-supplier=Element14; ComponentLink6Description: https://datasheet.ciiva.com/7777/1720486-7777565.pdf?src-supplier=Element14; ComponentLink7URL: https://datasheet.ciiva.com/16341/dcrcwe3-16341530.pdf?src-supplier=Future+Electronics; ComponentLink7Description: https://datasheet.ciiva.com/16341/dcrcwe3-16341530.pdf?src-supplier=Future+Electronics; ComponentLink8URL: https://datasheet.ciiva.com/16852/dcrcwe3-16852810.pdf?src-supplier=Avnet+Europe; ComponentLink8Description: https://datasheet.ciiva.com/16852/dcrcwe3-16852810.pdf?src-supplier=Avnet+Europe; ComponentLink9URL: https://datasheet.ciiva.com/16720/70201119-16720891.pdf?src-supplier=Allied+Electronics; ComponentLink9Description: https://datasheet.ciiva.com/16720/70201119-16720891.pdf?src-supplier=Allied+Electronics
R9 R12 = CMP-2001-04934-2: RES Thick Film, 12kΩ, 1%, 0.125W, 100ppm/°C, 0805; Manufacturer 1: Vishay; Voltage Rating (DC): 150V; Height: 0.45mm; Power Rating: 125mW; Temperature Coefficient: 100ppm/°C; Min Operating Temperature: -55°C; Case/Package: 0805; Case Code (Imperial): 0805; Contact Plating: Tin; Weight: 0.000194oz; Max Operating Temperature: 155°C; Features: Automotive AEC-Q200; Mount: Surface Mount; Composition: Thick Film; Number of Terminations: 2; Military Standard: Not; Package Quantity: 10; Width: 0.049inch; Lead Free: Lead Free; Length: 2mm; Depth: 1.25mm; Packaging: Tape and Reel; Radiation Hardening: No; Case Code (Metric): 2012; Voltage Rating: 150V; Termination: SMD/SMT; Supplier 1: Digi-Key; Supplier Part Number 1: 541-12.0KCCT-ND; Manufacturer Part Number 1: CRCW080512K0FKEA; RoHS: Yes; Category: Chip SMD Resistors; Stock 1: 2287; Pricing 1: 1=0.10000, 10=0.06700, 100=0.02710, 1000=0.01219, 2500=0.01058 (USD); Size Code: 0805; Resistor Type: Thick Film; Series: CRCW; Construction: Rectangular; Resistance Tolerance: 1%; Technology: THICK FILM; RoHS Compliant: Yes; REACH SVHC: Unknown; ComponentLink1URL: https://datasheet.ciiva.com/11809/0900766b80d98b26-11809216.pdf?src-supplier=RSComponents; ComponentLink1Description: https://datasheet.ciiva.com/11809/0900766b80d98b26-11809216.pdf?src-supplier=RSComponents; ComponentLink2URL: https://datasheet.ciiva.com/2467/dcrcwe3-2467344.pdf?src-supplier=Digi-Key; ComponentLink2Description: https://datasheet.ciiva.com/2467/dcrcwe3-2467344.pdf?src-supplier=Digi-Key; ComponentLink3URL: https://datasheet.ciiva.com/2467/dcrcwe3-2467345.pdf?src-supplier=Digi-Key; ComponentLink3Description: https://datasheet.ciiva.com/2467/dcrcwe3-2467345.pdf?src-supplier=Digi-Key; ComponentLink4URL: https://datasheet.ciiva.com/2467/dcrcwe3-2467346.pdf?src-supplier=Digi-Key; ComponentLink4Description: https://datasheet.ciiva.com/2467/dcrcwe3-2467346.pdf?src-supplier=Digi-Key; ComponentLink5URL: https://datasheet.ciiva.com/16883/dcrcwe3-16883879.pdf?src-supplier=Avnet+Europe; ComponentLink5Description: https://datasheet.ciiva.com/16883/dcrcwe3-16883879.pdf?src-supplier=Avnet+Europe; ComponentLink6URL: https://datasheet.ciiva.com/16397/dcrcw-16397325.pdf?src-supplier=Future+Electronics; ComponentLink6Description: https://datasheet.ciiva.com/16397/dcrcw-16397325.pdf?src-supplier=Future+Electronics; ComponentLink7URL: https://datasheet.ciiva.com/7841/1697337-7841630.pdf?src-supplier=Element14; ComponentLink7Description: https://datasheet.ciiva.com/7841/1697337-7841630.pdf?src-supplier=Element14; ComponentLink8URL: https://datasheet.ciiva.com/16777/70201119-16777994.pdf?src-supplier=Allied+Electronics; ComponentLink8Description: https://datasheet.ciiva.com/16777/70201119-16777994.pdf?src-supplier=Allied+Electronics
R10 R13 = CMP-2001-03873-2: RES Thick Film, 3.09kΩ, 1%, 0.125W, 100ppm/°C, 0805; Manufacturer 1: Vishay; Voltage Rating (DC): 150V; Max Power Dissipation: 125mW; Package Quantity: 10; Height: 0.02inch; Min Operating Temperature: -55°C; Number of Terminations: 2; Case Code (Metric): 2012; Case/Package: 0805; Composition: Thick Film; Max Operating Temperature: 155°C; Depth: 1.25mm; Number of Pins: 2; Packaging: Tape and Reel; Width: 0.049inch; Temperature Coefficient: 100ppm/°C; Voltage Rating: 150V; Military Standard: Not; Weight: 0.000194oz; Features: Automotive AEC-Q200; Case Code (Imperial): 0805; Radiation Hardening: No; Contact Plating: Tin; Lead Free: Lead Free; Length: 2mm; Termination: Solder; Supplier 1: Digi-Key; Supplier Part Number 1: 541-3.09KCCT-ND; Manufacturer Part Number 1: CRCW08053K09FKEA; RoHS: Yes; Category: Chip SMD Resistors; Stock 1: 4900; Pricing 1: 1=0.10000, 10=0.06700, 100=0.02710, 1000=0.01219, 2500=0.01058 (USD); Size Code: 0805; Series: CRCW; Resistor Type: Thick Film; Construction: Rectangular; Technology: THICK FILM; Resistance Tolerance: 1%; RoHS Compliant: Yes; REACH SVHC: Unknown; ComponentLink1URL: https://datasheet.ciiva.com/9081/dcrcwe3-9081688.pdf?src-supplier=Avnet; ComponentLink1Description: https://datasheet.ciiva.com/9081/dcrcwe3-9081688.pdf?src-supplier=Avnet; ComponentLink2URL: https://datasheet.ciiva.com/2467/dcrcwe3-2467557.pdf?src-supplier=Digi-Key; ComponentLink2Description: https://datasheet.ciiva.com/2467/dcrcwe3-2467557.pdf?src-supplier=Digi-Key; ComponentLink3URL: https://datasheet.ciiva.com/2467/dcrcwe3-2467558.pdf?src-supplier=Digi-Key; ComponentLink3Description: https://datasheet.ciiva.com/2467/dcrcwe3-2467558.pdf?src-supplier=Digi-Key; ComponentLink4URL: https://datasheet.ciiva.com/2467/dcrcwe3-2467559.pdf?src-supplier=Digi-Key; ComponentLink4Description: https://datasheet.ciiva.com/2467/dcrcwe3-2467559.pdf?src-supplier=Digi-Key; ComponentLink5URL: https://datasheet.ciiva.com/5549/dcrcwe3-109170-5549629.pdf?src-supplier=Mouser; ComponentLink5Description: https://datasheet.ciiva.com/5549/dcrcwe3-109170-5549629.pdf?src-supplier=Mouser; ComponentLink6URL: https://datasheet.ciiva.com/7670/1697337-7670298.pdf?src-supplier=Element14; ComponentLink6Description: https://datasheet.ciiva.com/7670/1697337-7670298.pdf?src-supplier=Element14; ComponentLink7URL: https://datasheet.ciiva.com/7670/1697337-7670299.pdf?src-supplier=Element14; ComponentLink7Description: https://datasheet.ciiva.com/7670/1697337-7670299.pdf?src-supplier=Element14; ComponentLink8URL: https://datasheet.ciiva.com/22675/1847332-22675199.pdf?src-supplier=Element14; ComponentLink8Description: https://datasheet.ciiva.com/22675/1847332-22675199.pdf?src-supplier=Element14; ComponentLink9URL: https://datasheet.ciiva.com/7178/1635184-7178791.pdf?src-supplier=Newark; ComponentLink9Description: https://datasheet.ciiva.com/7178/1635184-7178791.pdf?src-supplier=Newark; ComponentLink10URL: https://datasheet.ciiva.com/22871/70201119-22871769.pdf?src-supplier=Allied+Electronics; ComponentLink10Description: https://datasheet.ciiva.com/22871/70201119-22871769.pdf?src-supplier=Allied+Electronics; ComponentLink11URL: https://datasheet.ciiva.com/16780/70201119-16780488.pdf?src-supplier=Allied+Electronics; ComponentLink11Description: https://datasheet.ciiva.com/16780/70201119-16780488.pdf?src-supplier=Allied+Electronics; Supplier 2: Digi-Key; Supplier Part Number 2: 541-3.09KCDKR-ND; Manufacturer 2: Vishay; Manufacturer Part Number 2: CRCW08053K09FKEA; Stock 2: 4900; Pricing 2: 1=0.10000, 10=0.06700, 100=0.02710, 1000=0.01219, 2500=0.01058 (USD); Supplier 3: Mouser; Supplier Part Number 3: 71-CRCW0805-3.09K-E3; Manufacturer 3: Vishay; Manufacturer Part Number 3: CRCW08053K09FKEA; Stock 3: 6174; Pricing 3: 1=0.18000, 10=0.06800, 50=0.06800, 100=0.02800, 1000=0.01500, 10000=0.00900 (USD)
R11 R15 = CMP-1013-00531-2: Manufacturer: Vishay Dale; Manufacturer 1: Vishay; Tolerance: 1%; Temperature Coefficient: 100ppm/°C; Max Power Dissipation: 125mW; Voltage Rating (DC): 150V; Part Number: CRCW08051K60FKEA; Supplier 1: Digi-Key; Supplier Part Number 1: 541-1.60KCCT-ND; Manufacturer Part Number 1: CRCW08051K60FKEA; RoHS: Yes; Category: Chip SMD Resistors; Stock 1: 11753; Pricing 1: 1=0.10000, 10=0.06700, 100=0.02710, 1000=0.01219, 2500=0.01058 (USD); Case/Package: 0805; Number of Pins: 2; Case Code (Metric): 2012; Case Code (Imperial): 0805; Contact Plating: Tin; Weight: 0.000194oz; Size Code: 0805; Min Operating Temperature: -55°C; Max Operating Temperature: 155°C; Resistor Type: Thick Film; Packaging: Tape and Reel; Package Quantity: 5000; Number of Terminations: 2; Series: CRCW; Power Rating: 125mW; Voltage Rating: 150V; Termination: SMD/SMT; Features: Automotive AEC-Q200; Construction: Rectangular; Technology: THICK FILM; Resistance Tolerance: 1%; Length: 2mm; Width: 0.049inch; Height: 0.45mm; Depth: 1.25mm; Radiation Hardening: No; RoHS Compliant: Yes; Lead Free: Lead Free; Military Standard: Not; REACH SVHC: Unknown; ComponentLink1URL: https://datasheet.ciiva.com/11808/0900766b80d98b26-11808292.pdf?src-supplier=RSComponents; ComponentLink1Description: https://datasheet.ciiva.com/11808/0900766b80d98b26-11808292.pdf?src-supplier=RSComponents; ComponentLink2URL: https://datasheet.ciiva.com/5542/dcrcwe3-109170-5542582.pdf?src-supplier=Mouser; ComponentLink2Description: https://datasheet.ciiva.com/5542/dcrcwe3-109170-5542582.pdf?src-supplier=Mouser; ComponentLink3URL: https://datasheet.ciiva.com/2495/dcrcwe3-2495824.pdf?src-supplier=Digi-Key; ComponentLink3Description: https://datasheet.ciiva.com/2495/dcrcwe3-2495824.pdf?src-supplier=Digi-Key; ComponentLink4URL: https://datasheet.ciiva.com/2495/dcrcwe3-2495825.pdf?src-supplier=Digi-Key; ComponentLink4Description: https://datasheet.ciiva.com/2495/dcrcwe3-2495825.pdf?src-supplier=Digi-Key; ComponentLink5URL: https://datasheet.ciiva.com/2495/dcrcwe3-2495826.pdf?src-supplier=Digi-Key; ComponentLink5Description: https://datasheet.ciiva.com/2495/dcrcwe3-2495826.pdf?src-supplier=Digi-Key; ComponentLink6URL: https://datasheet.ciiva.com/26312/fld-crcw-e3-data-en-26312927.pdf?src-supplier=Distrelec; ComponentLink6Description: https://datasheet.ciiva.com/26312/fld-crcw-e3-data-en-26312927.pdf?src-supplier=Distrelec; ComponentLink7URL: https://datasheet.ciiva.com/7670/1697337-7670266.pdf?src-supplier=Element14; ComponentLink7Description: https://datasheet.ciiva.com/7670/1697337-7670266.pdf?src-supplier=Element14; ComponentLink8URL: https://datasheet.ciiva.com/7670/1697337-7670267.pdf?src-supplier=Element14; ComponentLink8Description: https://datasheet.ciiva.com/7670/1697337-7670267.pdf?src-supplier=Element14; ComponentLink9URL: https://datasheet.ciiva.com/22700/1697337-22700735.pdf?src-supplier=Element14; ComponentLink9Description: https://datasheet.ciiva.com/22700/1697337-22700735.pdf?src-supplier=Element14; ComponentLink10URL: https://datasheet.ciiva.com/16852/dcrcwe3-16852921.pdf?src-supplier=Avnet+Europe; ComponentLink10Description: https://datasheet.ciiva.com/16852/dcrcwe3-16852921.pdf?src-supplier=Avnet+Europe; ComponentLink11URL: https://datasheet.ciiva.com/7725/66915-7725838.pdf?src-supplier=Element14; ComponentLink11Description: https://datasheet.ciiva.com/7725/66915-7725838.pdf?src-supplier=Element14; ComponentLink12URL: https://datasheet.ciiva.com/22683/1847332-22683309.pdf?src-supplier=Element14; ComponentLink12Description: https://datasheet.ciiva.com/22683/1847332-22683309.pdf?src-supplier=Element14; Supplier 2: Digi-Key; Supplier Part Number 2: 541-1.60KCDKR-ND; Manufacturer 2: Vishay; Manufacturer Part Number 2: CRCW08051K60FKEA; Stock 2: 11753; Pricing 2: 1=0.10000, 10=0.06700, 100=0.02710, 1000=0.01219, 2500=0.01058 (USD); Supplier 3: Digi-Key; Supplier Part Number 3: 541-1.60KCTR-ND; Manufacturer 3: Vishay; Manufacturer Part Number 3: CRCW08051K60FKEA; Stock 3: 10000; Pricing 3: 5000=0.00874 (USD)
R16 R17 R34 = CMP-2001-04908-2: RES Thick Film, 10kΩ, 1%, 0.125W, 100ppm/°C, 0805; Manufacturer 1: Vishay; Voltage Rating (DC): 150V; Weight: 0.000194oz; Package Quantity: 5000; Military Standard: Not; Max Operating Temperature: 155°C; Temperature Coefficient: 100ppm/°C; Contact Plating: Tin; Width: 1.25mm; Height: 0.45mm; Radiation Hardening: No; Tolerance: 1%; Min Operating Temperature: -55°C; Voltage Rating: 150V; Length: 2mm; Depth: 1.25mm; Termination: SMD/SMT; Packaging: Tape and Reel; Case/Package: 0805; Case Code (Metric): 2012; Lead Free: Lead Free; Case Code (Imperial): 0805; Composition: Thick Film; Supplier 1: Newark; Supplier Part Number 1: 68AH8357; Manufacturer Part Number 1: CRCW080510K0FKEA; RoHS: Yes; Category: Chip SMD Resistors; Stock 1: 16518; Pricing 1: 1=0.18000, 25=0.06500, 50=0.04600, 100=0.02700 (USD); Size Code: 0805; Series: CRCW; Max Power Dissipation: 125mW; Resistor Type: Thick Film; Number of Terminations: 2; Features: Automotive AEC-Q200; Construction: Rectangular; Technology: THICK FILM; REACH SVHC: Unknown; RoHS Compliant: Yes; ComponentLink1URL: https://datasheet.ciiva.com/11808/0900766b80d98b26-11808216.pdf?src-supplier=RSComponents; ComponentLink1Description: https://datasheet.ciiva.com/11808/0900766b80d98b26-11808216.pdf?src-supplier=RSComponents; ComponentLink2URL: https://datasheet.ciiva.com/8337/dcrcwe3-8337773.pdf?src-supplier=Avnet; ComponentLink2Description: https://datasheet.ciiva.com/8337/dcrcwe3-8337773.pdf?src-supplier=Avnet; ComponentLink3URL: https://datasheet.ciiva.com/8337/dcrcwe3-8337774.pdf?src-supplier=Avnet; ComponentLink3Description: https://datasheet.ciiva.com/8337/dcrcwe3-8337774.pdf?src-supplier=Avnet; ComponentLink4URL: https://datasheet.ciiva.com/5547/dcrcwe3-109170-5547559.pdf?src-supplier=Mouser; ComponentLink4Description: https://datasheet.ciiva.com/5547/dcrcwe3-109170-5547559.pdf?src-supplier=Mouser; ComponentLink5URL: https://datasheet.ciiva.com/46394/1720486-46394381.pdf?src-supplier=Element14; ComponentLink5Description: https://datasheet.ciiva.com/46394/1720486-46394381.pdf?src-supplier=Element14; ComponentLink6URL: https://datasheet.ciiva.com/16199/dcrcwe3-16199086.pdf?src-supplier=Future+Electronics; ComponentLink6Description: https://datasheet.ciiva.com/16199/dcrcwe3-16199086.pdf?src-supplier=Future+Electronics; ComponentLink7URL: https://datasheet.ciiva.com/16883/dcrcwe3-16883708.pdf?src-supplier=Avnet+Europe; ComponentLink7Description: https://datasheet.ciiva.com/16883/dcrcwe3-16883708.pdf?src-supplier=Avnet+Europe; ComponentLink8URL: https://datasheet.ciiva.com/16719/70201119-16719082.pdf?src-supplier=Allied+Electronics; ComponentLink8Description: https://datasheet.ciiva.com/16719/70201119-16719082.pdf?src-supplier=Allied+Electronics; ComponentLink9URL: https://datasheet.ciiva.com/16514/dcrcwe3-16514907.pdf?src-supplier=Avnet+Asia; ComponentLink9Description: https://datasheet.ciiva.com/16514/dcrcwe3-16514907.pdf?src-supplier=Avnet+Asia; ComponentLink10URL: https://datasheet.ciiva.com/16755/70201119-16755389.pdf?src-supplier=Allied+Electronics; ComponentLink10Description: https://datasheet.ciiva.com/16755/70201119-16755389.pdf?src-supplier=Allied+Electronics; Supplier 2: Digi-Key; Supplier Part Number 2: 541-10.0KCCT-ND; Manufacturer 2: Vishay; Manufacturer Part Number 2: CRCW080510K0FKEA; Pricing 2: 1=0.10000, 10=0.06700, 100=0.02710, 1000=0.01219, 2500=0.01058 (USD); Supplier 3: Digi-Key; Supplier Part Number 3: 541-10.0KCDKR-ND; Manufacturer 3: Vishay; Manufacturer Part Number 3: CRCW080510K0FKEA; Pricing 3: 1=0.10000, 10=0.06700, 100=0.02710, 1000=0.01219, 2500=0.01058 (USD); Supplier 4: Digi-Key; Supplier Part Number 4: 541-10.0KCTR-ND; Manufacturer 4: Vishay; Manufacturer Part Number 4: CRCW080510K0FKEA; Pricing 4: 5000=0.00874 (USD)
R33 R35 = ERJP06J161V: RES SMD 160 OHM 5% 1/2W 0805; Manufacturer 1: Panasonic; Manufacturer Part Number 1: ERJ-P06J161V; Temperature Coefficient: 200ppm/°C; Power Rating: 500mW; Voltage Rating: 150V; MP: ERJP06J161V; Price: None; Package: None; Value: *; Availability: Unavailable; Supplier 1: Digi-Key; Supplier Part Number 1: P160ADCT-ND; RoHS: Yes; Category: Chip SMD Resistors; Stock 1: 25408; Pricing 1: 1=0.12000, 10=0.10800, 100=0.04140, 1000=0.01822, 2500=0.01573 (USD); Mount: Surface Mount; Case/Package: 0805; Contact Plating: Tin; Case Code (Imperial): 0805; Case Code (Metric): 2012; Min Operating Temperature: -55°C; Max Operating Temperature: 155°C; Tolerance: 5%; Resistor Type: Thick Film; Package Quantity: 5000; Packaging: Tape and Reel; Number of Terminations: 2; Max Power Dissipation: 500mW; Voltage Rating (DC): 150V; Features: Automotive AEC-Q200; Series: ERJ; Length: 0.079inch; Width: 1.2mm; Height: 0.028inch; Radiation Hardening: No; Lead Free: Contains Lead; RoHS Compliant: Yes; ComponentLink1URL: http://www.mouser.com/ds/2/315/AOA0000CE4-64075.pdf?src-supplier=Mouser; ComponentLink1Description: http://www.mouser.com/ds/2/315/AOA0000CE4-64075.pdf?src-supplier=Mouser; ComponentLink2URL: http://www.onlinecomponents.com/datasheet/erj-p06j161v.aspx?p=44459141&src-supplier=Onlinecomponents.com; ComponentLink2Description: http://www.onlinecomponents.com/datasheet/erj-p06j161v.aspx?p=44459141&src-supplier=Onlinecomponents.com; ComponentLink3URL: https://industrial.panasonic.com/cdbs/www-data/pdf/RDO0000/AOA0000C331.pdf?src-supplier=Digi-Key; ComponentLink3Description: https://industrial.panasonic.com/cdbs/www-data/pdf/RDO0000/AOA0000C331.pdf?src-supplier=Digi-Key; ComponentLink4URL: https://industrial.panasonic.com/ww/system/files/data/download/catalog/id_fixed-resistors_e_1.pdf?src-supplier=Digi-Key; ComponentLink4Description: https://industrial.panasonic.com/ww/system/files/data/download/catalog/id_fixed-resistors_e_1.pdf?src-supplier=Digi-Key; ComponentLink5URL: http://industrial.panasonic.com/www-data/pdf/AOA0000/AOA0000CE4.pdf?src-supplier=Avnet; ComponentLink5Description: http://industrial.panasonic.com/www-data/pdf/AOA0000/AOA0000CE4.pdf?src-supplier=Avnet; ComponentLink6URL: http://industrial.panasonic.com/www-data/pdf/AOA0000/AOA0000CE4.pdf?src-supplier=Avnet+Europe; ComponentLink6Description: http://industrial.panasonic.com/www-data/pdf/AOA0000/AOA0000CE4.pdf?src-supplier=Avnet+Europe
U3 = CMP-2000-07488-1: Swicth, SPST, 24 V, -35 to 85 degC, 4-Pin SMD, RoHS, Tape and Reel; Manufacturer 1: E-Switch; Mechanical Life: 100000Cycles; Actuator Material: Nylon,Polyamide; Operating Force: 260gf; Current Rating: 50mA; Voltage Rating (DC): 12V; Max Voltage Rating (DC): 50V; Illumination Type: Non-Illuminated,Illuminated; Switch Travel: 0.25mm; Switch Function: Off-Mom; Actuator Type: Standard; Contact Resistance: 100mR; Actuator Length: 0.7mm; Supplier 1: Digi-Key; Manufacturer Part Number 1: TL3301NF260QG; RoHS: Yes; Category: Tactile Switches; Stock 1: 8223; Pricing 1: 1=0.42000, 10=0.40400, 25=0.38040, 100=0.33030, 250=0.29968, 500=0.27876 (USD); Mount: Surface Mount; Contact Material: Silver; Color: Black; Contact Plating: Silver; Min Operating Temperature: -20°C; Max Operating Temperature: 70°C; Termination: Gull Wing; Packaging: Tape and Reel; Package Quantity: 1; Throw Configuration: SPST; Series: TL3301; Orientation: Straight; Contact Current Rating: 50mA; Electrical Life: 100000Cycles; Voltage Rating: 50V; Insulation Resistance: 100MR; Length: 6mm; Width: 6mm; Lead Free: Lead Free; REACH SVHC: No SVHC; RoHS Compliant: Yes; ComponentLink1URL: https://datasheet.ciiva.com/2901/p010517e-2901296.pdf?src-supplier=Digi-Key; ComponentLink1Description: https://datasheet.ciiva.com/2901/p010517e-2901296.pdf?src-supplier=Digi-Key; ComponentLink2URL: https://datasheet.ciiva.com/2901/tl3301-2901294.pdf?src-supplier=Digi-Key; ComponentLink2Description: https://datasheet.ciiva.com/2901/tl3301-2901294.pdf?src-supplier=Digi-Key; ComponentLink3URL: https://datasheet.ciiva.com/2901/tl3301-2901295.pdf?src-supplier=Digi-Key; ComponentLink3Description: https://datasheet.ciiva.com/2901/tl3301-2901295.pdf?src-supplier=Digi-Key; ComponentLink4URL: https://datasheet.ciiva.com/7637/tl3301-7637661.pdf?src-supplier=Element14; ComponentLink4Description: https://datasheet.ciiva.com/7637/tl3301-7637661.pdf?src-supplier=Element14; Supplier 2: Digi-Key; Supplier Part Number 2: EG1868CT-ND; Supplier Part Number 1: EG1868CT-ND